# EAGLE design schematic (EAGLE 7.4.0)
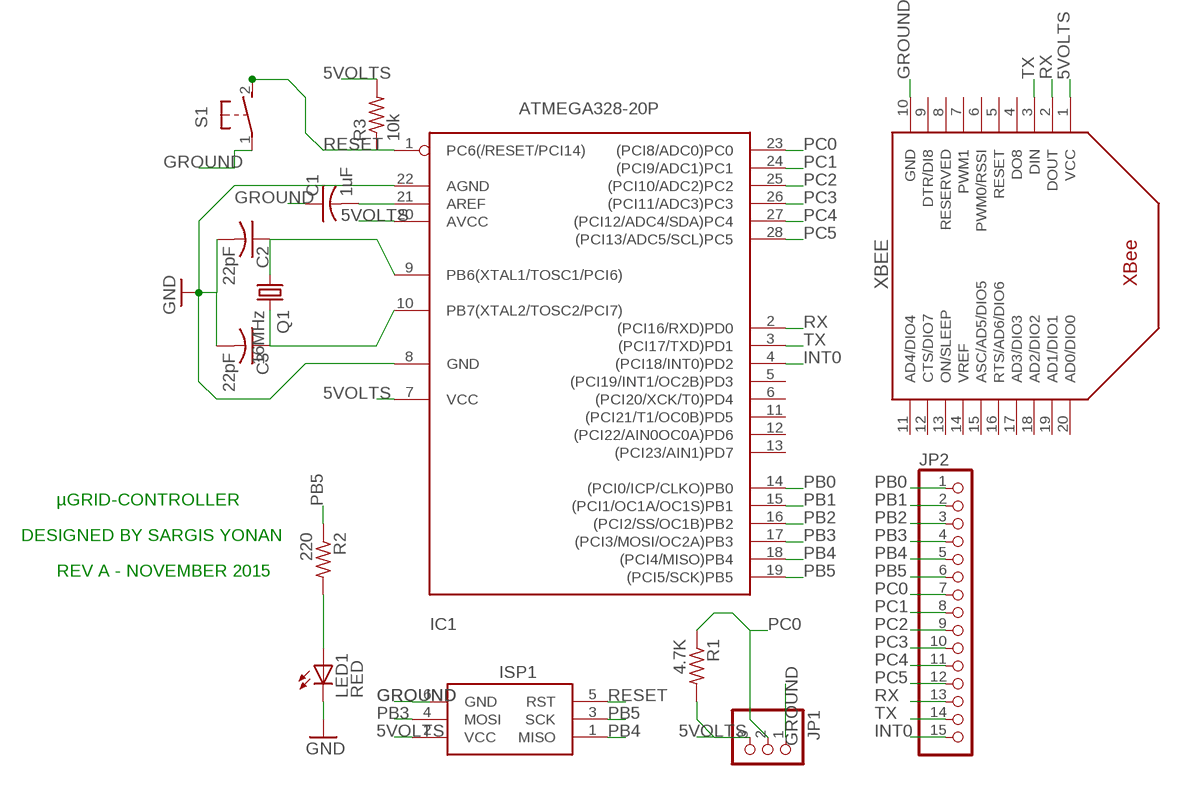
[diagram p0: schematic, sheet 1]

## Parts
C1  1uF  C-US025-024X044  [C025-024X044]
C2  22pF  C-US025-024X044  [C025-024X044]
C3  22pF  C-US025-024X044  [C025-024X044]
IC1  ATMEGA328-20P  [DIL28-3]
ISP1  AVRISP-6  [AVRISP]
JP1  PINHD-1X3  [1X03]
JP2  PINHD-1X15-CB  [1X15-CB]
LED1  RED  LED3MM  [LED3MM]
Q1  16MHz  CRYSTALHC18U-V  [HC18U-V]
R1  4.7K  R-US_0204/7  [0204/7]
R2  220  R-US_0204/7  [0204/7]
R3  10k  R-US_0204/7  [0204/7]
S1  31-XX  [B3F-31XX]
XBEE  XBEE  [XBEE]

## Nets
5VOLTS: IC1.7(VCC) IC1.20(AVCC) ISP1.2(VCC) JP1.3 R1.2 R3.2 XBEE.1(VCC)
GROUND: C1.1 C2.2 C3.2 IC1.8(GND) IC1.22(AGND) ISP1.6(GND) JP1.1 LED1.K(C) S1.1(P) XBEE.10(GND) ; supply symbol labelled GND
INT0: IC1.4((PCI18/INT0)PD2) JP2.15
N$1: C1.2 IC1.21(AREF)
N$9: LED1.A R2.2
N$11: C2.1 IC1.9(PB6(XTAL1/TOSC1/PCI6)) Q1.1
N$12: C3.1 IC1.10(PB7(XTAL2/TOSC2/PCI7)) Q1.2
PB0: IC1.14((PCI0/ICP/CLKO)PB0) JP2.1
PB1: IC1.15((PCI1/OC1A/OC1S)PB1) JP2.2
PB2: IC1.16((PCI2/SS/OC1B)PB2) JP2.3
PB3: IC1.17((PCI3/MOSI/OC2A)PB3) ISP1.4(MOSI) JP2.4
PB4: IC1.18((PCI4/MISO)PB4) ISP1.1(MISO) JP2.5
PB5: IC1.19((PCI5/SCK)PB5) ISP1.3(SCK) JP2.6 R2.1
PC0: IC1.23((PCI8/ADC0)PC0) JP1.2 JP2.7 R1.1
PC1: IC1.24((PCI9/ADC1)PC1) JP2.8
PC2: IC1.25((PCI10/ADC2)PC2) JP2.9
PC3: IC1.26((PCI11/ADC3)PC3) JP2.10
PC4: IC1.27((PCI12/ADC4/SDA)PC4) JP2.11
PC5: IC1.28((PCI13/ADC5/SCL)PC5) JP2.12
RESET: IC1.1(PC6(/RESET/PCI14)) ISP1.5(RST) R3.1 S1.2(S)
RX: IC1.2((PCI16/RXD)PD0) JP2.13 XBEE.2(DOUT)
TX: IC1.3((PCI17/TXD)PD1) JP2.14 XBEE.3(DIN)
Unconnected: IC1.5((PCI19/INT1/OC2B)PD3) IC1.6((PCI20/XCK/T0)PD4) IC1.11((PCI21/T1/OC0B)PD5) IC1.12((PCI22/AIN0OC0A)PD6) IC1.13((PCI23/AIN1)PD7) XBEE.4(DO8) XBEE.5(RESET) XBEE.6(PWM0/RSSI) XBEE.7(PWM1) XBEE.8(RESERVED) XBEE.9(DTR/DI8) XBEE.11(AD4/DIO4) XBEE.12(CTS/DIO7) XBEE.13(ON/SLEEP) XBEE.14(VREF) XBEE.15(ASC/AD5/DIO5) XBEE.16(RTS/AD6/DIO6) XBEE.17(AD3/DIO3) XBEE.18(AD2/DIO2) XBEE.19(AD1/DIO1) XBEE.20(AD0/DIO0)

## Notes on the sheet
- µGRID-CONTROLLER
- DESIGNED BY SARGIS YONAN
- REV A - NOVEMBER 2015

## Library data of the parts
C1-C3 = adafruit:C-US: CAPACITOR, American symbol
IC1 = atmega328:ATMEGA328*P: MICROCONTROLLER 32 kBytes FLASH 2 kBytes SRAM 1 kBytes EEPROM USART 8-channel 10 bit ADC
ISP1 = adafruit:AVRISP: AVR ISP HEADER Standard 6 pin header for AVR programming
JP1 = adafruit:PINHD-1X3: PIN HEADER
JP2 = adafruit:PINHD-1X15: PIN HEADER
LED1 = adafruit:LED: LED OSRAM: - CHIPLED LG R971, LG N971, LY N971, LG Q971, LY Q971, LO R971, LY R971 LH N974, LH R974 LS Q976, LO Q976, LY Q976 LO Q996 - Hyper CHIPLED LW Q18S LB Q993, LB Q99A, LB R99A - SideLED LS A670, LO A670, LY A670, LG A670, LP A670 LB A673, LV A673, LT A673, LW A673 LH A674 LY A675 LS A676, LA A676, LO A676, LY A676, LW A676 LS A679, LY A679, LG A679 - Hyper Micro SIDELED® LS Y876, LA Y876, LO Y876, LY Y876 LT Y87S - SmartLED LW L88C, LW L88S LB L89C, LB L89S, LG L890 LS L89K, LO L89K, LY L89K LS L896, LA L896, LO L896, LY L896 - TOPLED LS T670, LO T670, LY T670, LG T670, LP T670 LSG T670, LSP T670, LSY T670, LOP T670, LYG T670 LG T671, LOG T671, LSG T671 LB T673, LV T673, LT T673, LW T673 LH T674 LS T676, LA T676, LO T676, LY T676, LB T676, LH T676, LSB T676, LW T676 LB T67C, LV T67C, LT T67C, LS T67K, LO T67K, LY T67K, LW E67C LS E67B, LA E67B, LO E67B, LY E67B, LB E67C, LV E67C, LT E67C LW T67C LS T679, LY T679, LG T679 LS T770, LO T770, LY T770, LG T770, LP T770 LB T773, LV T773, LT T773, LW T773 LH T774 LS E675, LA E675, LY E675, LS T675 LS T776, LA T776, LO T776, LY T776, LB T776 LHGB T686 LT T68C, LB T68C - Hyper Mini TOPLED® LB M676 - Mini TOPLED Santana® LG M470 LS M47K, LO M47K, LY M47K Source: http://www.osram.convergy.de/
Q1 = adafruit:CRYSTAL: CRYSTAL; OC_FARNELL: unknown; OC_NEWARK: unknown
R1-R3 = adafruit:R-US_: RESISTOR, American symbol
S1 = adafruit:31-XX: OMRON SWITCH Now with beefier pads!
XBEE = adafruit:XBEE

## Net classes
0 default: width 0.305 mm, drill 0.508 mm, clearance 0.305 mm

## Board
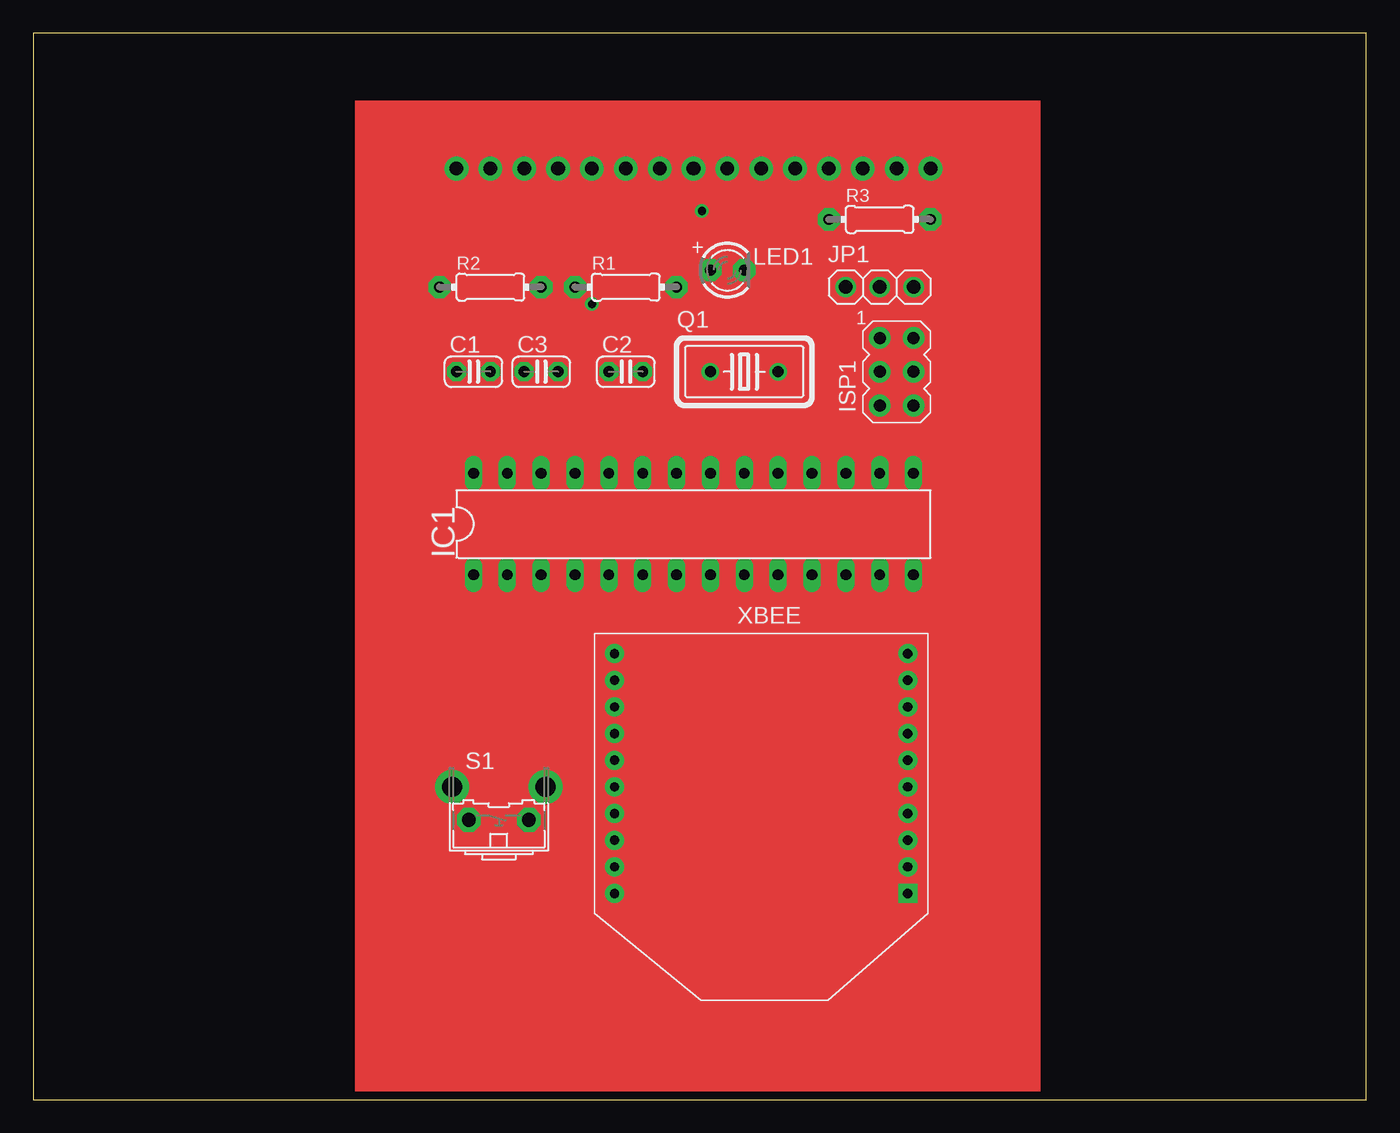
[diagram p1: board, top side]
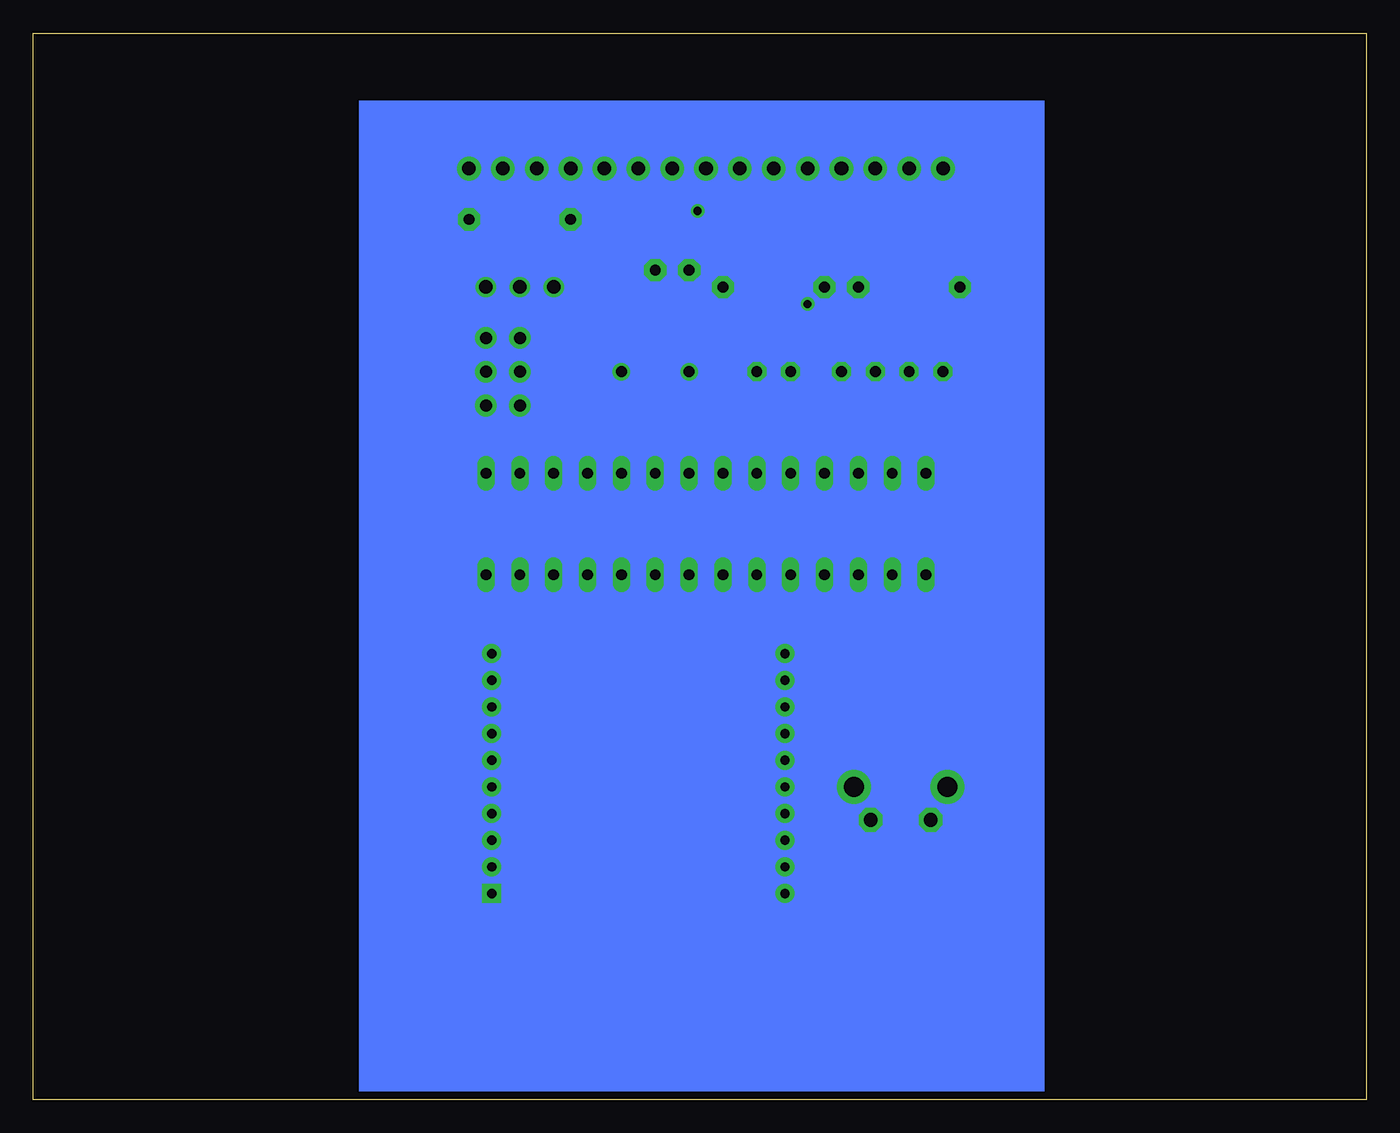
[diagram p2: board, bottom side, seen from below]

Size 100 x 80 mm. Coordinates in mm from the lower left corner, seen from the top.
Outline: 0,0 100,0 100,80 0,80 0,0
Copper layers (1*16): Top 0.035mm / dielectric 1.5mm / Bottom 0.035mm
Design rules "default": minimum track width 10mil, minimum drill 24mil, track to track 8mil, track to pad 8mil, pad to pad 8mil, via to via 8mil, smd to smd 8mil, copper to edge 40mil, drill to drill 8mil, minimum pad ring 10mil, minimum via ring 8mil, stop-mask expansion 4mil, vias tented up to drill 0mil, thermal gap 10mil

### Footprints (pad centres in the part's own frame; a part is rotated, then mirrored left to right if it is on the bottom)
C025-024X044 = drill 0.813 pad 1.422 octagon: 1 -1.27,0; 2 1.27,0
DIL28-3 = drill 0.813 long: 1 -16.51,-3.81; 2 -13.97,-3.81; 3 -11.43,-3.81; 4 -8.89,-3.81; 5 -6.35,-3.81; 6 -3.81,-3.81; 7 -1.27,-3.81; 8 1.27,-3.81; 9 3.81,-3.81; 10 6.35,-3.81; 11 8.89,-3.81; 12 11.43,-3.81; 13 13.97,-3.81; 14 16.51,-3.81; 15 16.51,3.81; 16 13.97,3.81; 17 11.43,3.81; 18 8.89,3.81; 19 6.35,3.81; 20 3.81,3.81; 21 1.27,3.81; 22 -1.27,3.81; 23 -3.81,3.81; 24 -6.35,3.81; 25 -8.89,3.81; 26 -11.43,3.81; 27 -13.97,3.81; 28 -16.51,3.81
AVRISP = drill 0.9 pad 1.626: 1 -1.27,2.54; 2 1.27,2.54; 3 -1.27,0; 4 1.27,0; 5 -1.27,-2.54; 6 1.27,-2.54
1X03 = drill 1.016: 1 -2.54,0; 2 0,0; 3 2.54,0
1X15-CB = drill 1.016 pad 1.778: 1 -17.78,0; 2 -15.24,0; 3 -12.7,0; 4 -10.16,0; 5 -7.62,0; 6 -5.08,0; 7 -2.54,0; 8 0,0; 9 2.54,0; 10 5.08,0; 11 7.62,0; 12 10.16,0; 13 12.7,0; 14 15.24,0; 15 17.78,0
LED3MM = drill 0.813 pad 1.676 octagon: A -1.27,0; K 1.27,0
HC18U-V = drill 0.813: 1 -2.54,0; 2 2.54,0
0204/7 = drill 0.813 pad 1.676 octagon: 1 -3.81,0; 2 3.81,0
B3F-31XX = drill 1.016 pad 1.778 octagon: 1 -2.261,-1.245; 2 2.261,-1.245 | drill 1.499 pad 2.54: 3 -3.505,1.245; 4 3.505,1.245
XBEE = drill 0.7 pad 1.422 square: 1 -11,5.5 | drill 0.7 pad 1.422: 2 -11,3.5; 3 -11,1.5; 4 -11,-0.5; 5 -11,-2.5; 6 -11,-4.5; 7 -11,-6.5; 8 -11,-8.5; 9 -11,-10.5; 10 -11,-12.5; 11 11,-12.5; 12 11,-10.5; 13 11,-8.5; 14 11,-6.5; 15 11,-4.5; 16 11,-2.5; 17 11,-0.5; 18 11,1.5; 19 11,3.5; 20 11,5.5

### Placement (x,y rotation side)
C1  33.02,54.61 0 top
C2  44.45,54.61 0 top
C3  38.1,54.61 0 top
IC1  49.53,43.18 0 top
ISP1  64.77,54.61 0 top
JP1  63.5,60.96 0 top
JP2  49.53,69.85 0 top
LED1  52.07,62.23 0 top
Q1  53.34,54.61 0 top
R1  44.45,60.96 0 top
R2  34.29,60.96 0 top
R3  63.5,66.04 0 top
S1  34.92,22.23 0 top
XBEE  54.61,20.95 180 top

### Tracks (layer width: path | path; a pad name or v marks a point on that pad's centre or on a via)
5VOLTS
  Top 0.254: JP1.3 ISP1.2 | R1.2 51.44,60.96 52.07,61.59 52.07,64.77 66.04,64.77 R3.2
  Bottom 0.254: IC1.7 46.99,40.64 46.99,59.69 47.62,60.33 | R1.2 47.62,60.33 | IC1.20 52.7,47.62 52.7,55.24 47.62,60.33 | XBEE.1 67.31,15.24 68.58,16.51 68.58,58.42 JP1.3 66.04,64.77 R3.2
GROUND
  Top 0.254: IC1.8 53.34,36.83 62.87,36.83 66.67,33.02 XBEE.10 | 59.69,62.23 JP1.1 | LED1.K 59.69,62.23 | C1.1 33.02,55.88 38.1,55.88 | C3.2 38.1,55.88 | C2.2 44.45,55.88 38.1,55.88 | ISP1.6 64.77,53.34 64.77,62.23 59.69,62.23
  Bottom 0.254: IC1.22 50.8,44.45 IC1.8 | ISP1.6 67.31,50.8 67.31,33.02 XBEE.10 | C1.1 31.75,25.6 | 31.75,25.6 31.75,24.13 | LED1.K 52.07,63.5 40.01,64.77 C2.2 | S1.1 32.69,21.03 32.69,22.4 33.15,22.86 33.15,24.23 31.77,25.6 31.75,25.6
INT0
  Top 0.254: IC1.4 42.55,41.27 61.59,41.27 62.23,40.64 62.23,37.47 66.67,37.47 69.22,40.01 69.22,69.85 JP2.15
N$1
  Top 0.254: IC1.21 48.9,45.09 42.55,45.09 41.91,45.72 41.91,52.07 36.83,52.07 C1.2
N$9
  Top 0.254: R2.2 39.37,62.23 LED1.A
N$11
  Top 0.254: Q1.1 49.53,53.34 44.45,53.34 C2.1
  Bottom 0.254: IC1.9 52.07,40.64 52.07,53.34 Q1.1
N$12
  Top 0.254: C3.1 38.73,52.7 53.98,52.7 Q1.2
  Bottom 0.254: IC1.10 54.61,40.64 54.61,53.34 Q1.2
PB0
  Top 0.254: IC1.14 61.59,43.81 32.38,43.81 27.94,48.26 27.94,69.85 JP2.1
PB1
  Top 0.254: IC1.15 63.5,44.45 33.02,44.45 28.57,48.9 28.57,68.58 33.02,68.58 JP2.2
PB2
  Bottom 0.254: IC1.16 62.23,48.26 62.23,65.41 58.42,69.22 58.42,70.48 56.52,72.39 36.83,72.39 JP2.3
PB3
  Top 0.254: IC1.17 64.77,50.8 66.67,50.8 67.31,51.44 67.31,54.61 | ISP1.4 67.31,54.61 | JP2.4 46.35,61.59 67.31,67.94 68.58,66.67 68.58,54.61 67.31,54.61
PB4  (via drill 0.61)
  Top 0.254: IC1.18 56.52,45.09 55.24,45.09 54.61,45.72 54.61,52.07 58.42,52.07 62.23,55.88 | ISP1.1 62.23,55.88 | v41.91,59.69 45.72,55.88 62.23,55.88
  Bottom 0.254: v41.91,59.69 JP2.5
PB5
  Top 0.254: ISP1.3 IC1.19 | R2.1 38.1,68.58 38.1,71.12 43.18,71.12 JP2.6
  Bottom 0.254: IC1.19 57.15,48.26 57.15,67.94 55.88,69.22 55.88,71.12 55.24,71.75 44.45,71.75 JP2.6
PC0
  Top 0.254: JP1.2 62.23,59.69 43.18,59.69 41.91,60.96 R1.1
  Bottom 0.254: IC1.23 43.81,45.09 41.91,45.09 41.91,58.42 | 41.91,58.42 40.64,59.69 R1.1 | JP2.7 46.35,69.22 46.35,66.67 43.18,63.5 43.18,59.69 41.91,58.42
PC1
  Bottom 0.254: IC1.24 44.45,48.26 44.45,63.5 49.53,68.58 JP2.8
PC2  (via drill 0.61)
  Top 0.254: IC1.25 34.29,53.34 31.11,53.34 30.48,53.98 30.48,59.69 34.92,59.69 41.91,66.67 v50.16,66.67
  Bottom 0.254: v50.16,66.67 52.07,68.58 JP2.9
PC3
  Bottom 0.254: IC1.26 38.1,59.05 39.37,60.33 39.37,67.94 40.64,69.22 40.64,70.48 41.27,71.12 43.18,71.12 43.18,69.22 43.81,68.58 45.72,68.58 45.72,70.48 46.35,71.12 54.61,71.12 JP2.10
PC4
  Top 0.254: IC1.27 29.21,53.34 29.21,67.94 34.29,67.94 35.56,69.22 35.56,71.75 55.24,71.75 JP2.11
PC5
  Bottom 0.254: IC1.28 35.56,49.53 35.56,72.39 36.2,73.03 59.69,73.03 JP2.12
RESET
  Bottom 0.254: ISP1.5 64.77,50.8 64.77,45.72 64.14,45.09 59.69,45.09 | R3.1 59.69,45.09 | 37.01,20.78 44.45,13.34 59.69,13.34 59.69,45.09 | 37.01,20.78 36.83,20.95 36.83,26.67 36.8,26.75 33.15,30.4 33.15,39.32 IC1.1 | S1.2 37.03,20.8 37.01,20.78
RX
  Top 0.254: IC1.2 40.64,34.29 49.53,34.29 66.67,17.14 XBEE.2
  Bottom 0.254: JP2.13 64.77,67.31 64.77,60.33 67.94,57.15 67.94,17.78 67.31,17.14 XBEE.2
TX
  Top 0.254: IC1.3 42.55,34.92 50.8,34.92 66.67,19.05 XBEE.3 67.31,19.05 69.85,19.05 69.85,70.48 69.22,71.12 66.04,71.12 JP2.14
(copper drawn outside any net)
  shapes: Bottom area x1, Top area x1

### Text on the board
Top: DESIGNED BY SARGIS YONAN